# EAGLE schematic MOTOR SCH (EAGLE 9.6.2)
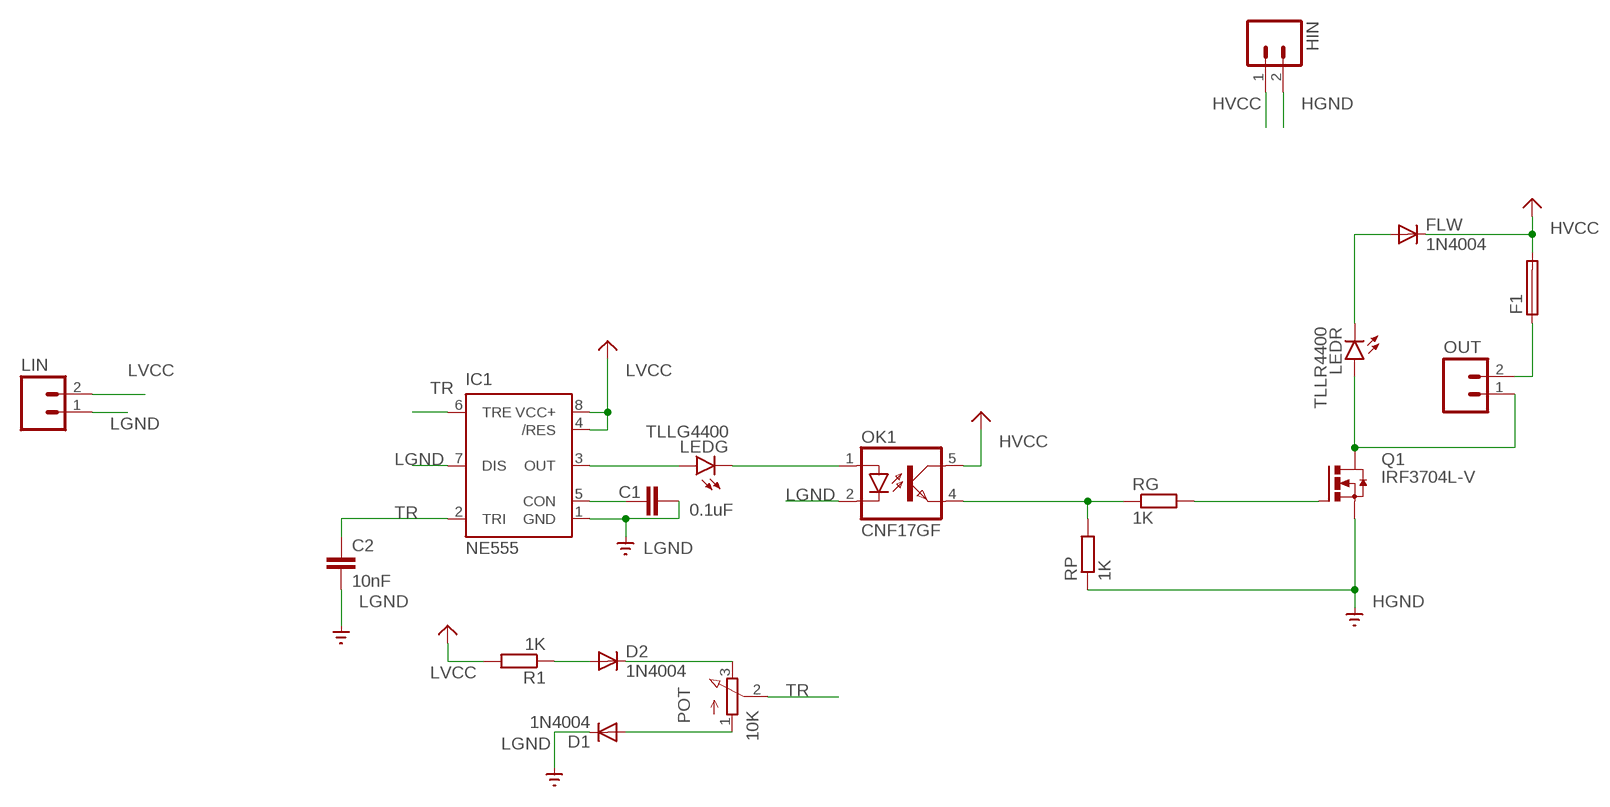
[diagram p0: schematic, sheet 1]

## Parts
C1  0.1uF  C2,5-3  [C2.5-3]
C2  10nF  C2,5-3  [C2.5-3]
D1  1N4004  [DO41-10]
D2  1N4004  [DO41-10]
F1  19559  [19559]
FLW  1N4004  [DO41-10]
HIN  M02  [02P]
IC1  NE555  [DIL-08]
LEDG  TLLG4400  [LED3MM]
LEDR  TLLR4400  [LED3MM]
LIN  M02  [02P]
OK1  CNF17GF  [DIL06B]
OUT  M02  [02P]
POT  10K  3RP/1610N  [3RP/1610N]
Q1  IRF3704L-V  [TO262-V]
R1  1K  R-EU_0204/7  [0204/7]
RG  1K  R-EU_0204/7  [0204/7]
RP  1K  R-EU_0204/7  [0204/7]

## Nets
CHA: D2.C POT.3(E)
CON: C1.2 IC1.5(CON)
DIS: D1.A POT.1(A)
DRAIN: LEDR.A OUT.1 Q1.2(D)
FCH: D2.A R1.1
FLW: FLW.A LEDR.K(C)
GATE: Q1.1(G) RG.2
HGND: HIN.2 Q1.3(S) RP.1 ; supply symbol labelled SUPPLY0_GND_
HVCC: F1.2 FLW.C HIN.1 OK1.5(COL) ; supply symbol labelled VCC
LGND: C1.1 C2.2 D1.C IC1.1(GND) IC1.7(DIS) LIN.1 OK1.2(C) ; supply symbol labelled SUPPLY0_GND_
LVCC: IC1.4(/RES) IC1.8(VCC+) LIN.2 R1.2 ; supply symbol labelled VCC
MOTOR-O: F1.1 OUT.2
OPTO-IN: LEDG.K(C) OK1.1(A)
OPTO-OUT: OK1.4(EMIT) RG.1 RP.2
OUT: IC1.3(OUT) LEDG.A
TR: C2.1 IC1.2(TRI) IC1.6(TRE) POT.2(S)

## Library data of the parts
C1 C2 = capacitor-wima:C: CAPACITOR naming: grid - package width
D1 D2 FLW = adafruit:1N4004: DIODE General purpose 1N400x type rectifier (With bigger pads) http://www.ladyada.net/library/pcb/eaglelibrary.html
F1 = fuse:19559: FUSE HOLDER TR5, Wickmann; MPN: 55900000001; OC_FARNELL: 9516360; OC_NEWARK: 02P0286
HIN LIN OUT = con-amp-quick:M02: AMP QUICK CONNECTOR; OC_FARNELL: unknown; OC_NEWARK: unknown
IC1 = st-microelectronics:NE555: General purpose bipolar Timer; MF: Arrow Electronics; MPN: NE555N; OC_FARNELL: 1467742; OC_NEWARK: 89K1486
LEDG = led:TLLG4400: Low Current (2mA) LED 3 mm Tinted Diffused Package color GREEN Source: Data sheet <http://www.farnell.com/datasheets/391098.pdf>; MF: VISHAY SEMICONDUCTOR; OC_FARNELL: 1612435
LEDR = led:TLLR4400: Low Current (2mA) LED 3 mm Tinted Diffused Package color RED Source: Data sheet <http://www.farnell.com/datasheets/391100.pdf>; MF: VISHAY SEMICONDUCTOR; OC_FARNELL: 1612437
OK1 = optocoupler:CNF17GF: HEWLETT PACKARD OPTO COUPLER; OC_FARNELL: unknown; OC_NEWARK: unknown
POT = pot:3RP/1610N: 16mm Potentiometer one level Source: http://www.alphapotentiometers.net/html/16mm_pot_2.html
Q1 = transistor-power:IRF3704: SMPS MOSFET HEXFET® Power MOSFET Source: http://www.irf.com/product-info/datasheets/data/irf3704.pdf
R1 RG RP = rcl:R-EU_: RESISTOR, European symbol; SPICEPREFIX: R